# Altium schematic sheet HV_Amp_Discrete.SchDoc: Power
size 420 x 297 mm; Author: G.Kasprowicz; CompanyName: WUT ISE; DrawnBy: G.Kasprowicz; Organization: WUT ISE; Address1: PW ISE; Address2: Nowowiejska 15/19 00-665 Warsaw; Address3: gkasprow@gmail.com; DocumentNumber: 2; Revision: 2; SheetNumber: 11; SheetTotal: 12; ModifiedBy: -; CheckedDate: -; Title2: Stage; DivGrp: WUT ISE; Designer: G.Kasprowicz; ModifiedDate: -; ProjectName: Sensor Box
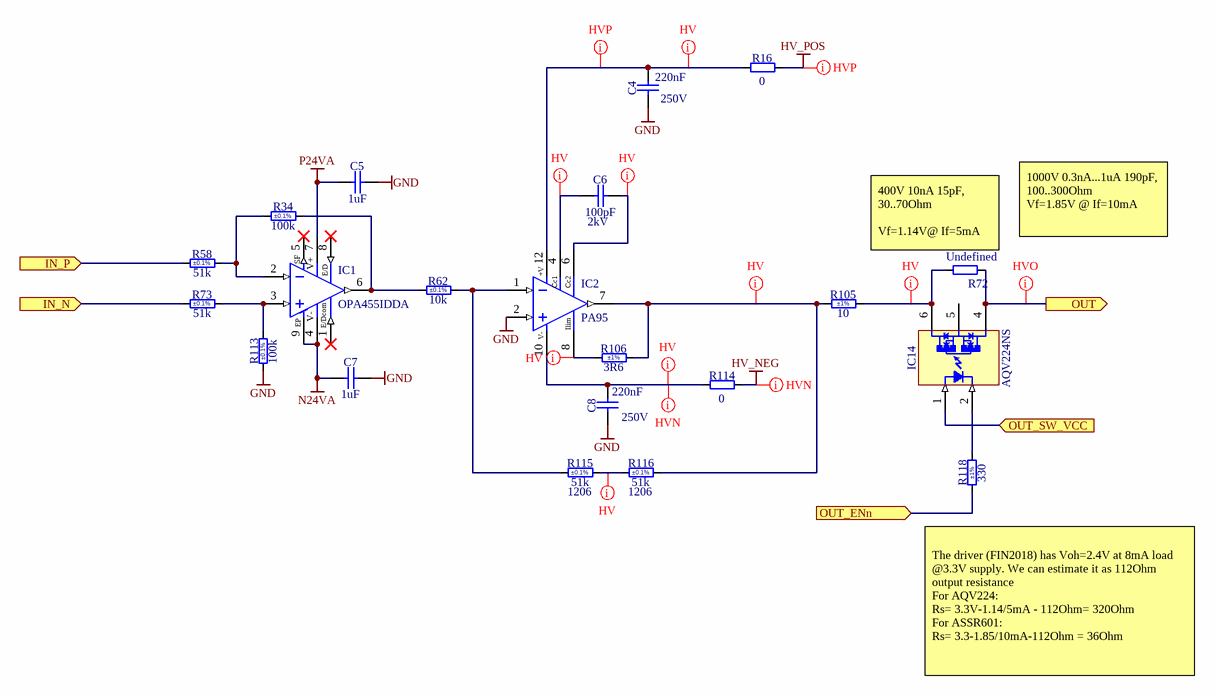
[diagram p0: HV_Amp_Discrete.SchDoc]

## Parts
C4  220nF  Voltage: 250V  [CAPC4532X165N]
C5  1uF  [CAPC1608X87N]
C6  100pF  Voltage: 2kV  [CAPC4620X203N]
C7  1uF  [CAPC1608X87N]
C8  220nF  Voltage: 250V  [CAPC4532X165N]
IC1  OPA455IDDA  [SOIC127P600X170-9N-R249X300]
IC2  PA95  [APEX_PA95_hflip]
IC14  AQV224NS  [PANASONIC_AQV22(SOP)]
R16  0  [RESC1608X55N]
R34  100k  Tolerance: ±0.1%  [RESC1608X55N]
R58  51k  Tolerance: ±0.1%  [RESC2012X60N]
R62  10k  Tolerance: ±0.1%  [RESC1608X64N]
R72  Undefined  [RESC3216X65N]
R73  51k  Tolerance: ±0.1%  [RESC2012X60N]
R105  10  Tolerance: ±1%  [RESC3216X65N]
R106  3R6  Tolerance: ±1%  [RESC1608X55N]
R113  100k  Tolerance: ±0.1%  [RESC1608X55N]
R114  0  [RESC1608X55N]
R115  51k  Tolerance: ±0.1%  Case: 1206  [RESC3216X65N]
R116  51k  Tolerance: ±0.1%  Case: 1206  [RESC3216X65N]
R118  330  Tolerance: ±1%  [RESC1005X40N]

## Ports
IN_N (in), IN_P (in), OUT (out), OUT_ENn (in), OUT_SW_VCC (in)

## Nets
GND: C4.1 C5.2 C7.2 C8.1 IC2.2(IN+) R113.1
HV_NEG: R114.2
HV_POS: R16.2
N24VA: C7.1 IC1.4(V-) IC1.9(Exposed_Pad)
P24VA: C5.1 IC1.7(V+)
IN_N: R73.1 ; port IN_N
IN_P: R58.1 ; port IN_P
OUT: IC14.4 R72.2 ; port OUT
OUT_ENn: R118.1 ; port OUT_ENn
OUT_SW_VCC: IC14.1(A) ; port OUT_SW_VCC
NetC4_2: C4.2 IC2.12(+Vs) R16.1
NetC6_1: C6.1 IC2.4(Cc1)
NetC6_2: C6.2 IC2.6(Cc2)
NetC8_2: C8.2 IC2.10(-Vs) R114.1
NetIC1_2: IC1.2(IN-) R34.1 R58.2
NetIC1_3: IC1.3(IN+) R73.2 R113.2
NetIC1_6: IC1.6(OUT) R34.2 R62.1
NetIC2_1: IC2.1(IN-) R62.2 R115.1
NetIC2_7: IC2.7(OUT) R105.1 R106.2 R116.2
NetIC2_8: IC2.8(ILIM) R106.1
NetIC14_2: IC14.2(K) R118.2
NetIC14_6: IC14.6 R72.1 R105.2
NetR115_2: R115.2 R116.1

Not connected (* = marked no-connect by the designer): IC1 1(E/Dcommon)* 5(Status_Flag)* 8(E/B)*; IC14 5

## Layout directives
net class HV: NetC4_2, NetC6_1, NetC6_2, NetC8_2, NetIC2_7, NetIC2_8, NetIC14_6, NetR115_2
net class HVP: HV_POS, NetC4_2
net class HVN: HV_NEG, NetC8_2
net class HVO: OUT

## Notes on the sheet
- (near R72) 400V 10nA 15pF, 30..70Ohm
  Vf=1.14V@ If=5mA
- (near R72) 1000V 0.3nA...1uA 190pF, 100..300Ohm
  Vf=1.85V @ If=10mA
- (near R118) The driver (FIN2018) has Voh=2.4V at 8mA load @3.3V supply. We can estimate it as 112Ohm output resistance
  For AQV224:
  Rs= 3.3V-1.14/5mA - 112Ohm= 320Ohm
  For ASSR601:
  Rs= 3.3-1.85/10mA-112Ohm = 36Ohm
- Project/Equipment
- Document
- Designer
- Drawn by
- Check.by
- Copyright WUT ISE 2020.
  This documentation describes Open Hardware and is licensed under the CERN OHL v.1.2. You may redistribute and modify this documentation under the terms of the CERN OHL v.1.2. (http://ohwr.org/CERNOHL). This documentation is distributed WITHOUT ANY EXPRESS OR IMPLIED WARRANTY, INCLUDING OF MERCHANTABILITY, SATISFACTORY QUALITY AND FITNESS FOR A PARTICULAR PURPOSE. Please see the CERN OHL v.1.2 for applicable conditions.
- Contact
- File
- Last Mod.
- Print Date
- Sheet
- Size
- A3
- of
- Rev
- (in symbol OA_OPA455) SF; E/D; E/Dcom; EP
- (in symbol OA_PA95) +V; V-; Ilim

## Library data of the parts
C4 C8 = CC1812_220NF_250V_10%_X7R_FT-CAP: Non-polarised capacitor; Part Description: Flexible Termination System (FT-CAP) SMD Multilayer Ceramic  Chip Capacitor; Manufacturer: KEMET; Manufacturer Part Number: C1812X224KARACTU; TC: X7R; Tolerance: ±10%; Part Number: CC1812_220NF_250V_10%_X7R_FT-CAP; Component Kind: Standard; Component Type: Standard; Pin Count: 2; Value: 220nF; Status: None; Case: 1812; Mounted: Yes; Socket: No; SMD: Yes; Sense: No; ComponentHeight: 1.65mm; HelpURL: \\cern.ch\dfs\Applications\Altium\Datasheets\CC1812_X7R_KEMET_FT-CAP.pdf; Author: CERN DEM JLC; CreateDate: 09.08.2018; LatestRevisionDate: 09.08.2018
C5 C7 = CC0603_1UF_50V_10%_X5R: Non-polarised capacitor; Part Description: SMD Multilayer Chip Ceramic Capacitor; Manufacturer: GENERIC; Manufacturer1 Part Number: C1608X5R1H105K080; Voltage: 50V; TC: X5R; Tolerance: ±10%; Part Number: CC0603_1UF_50V_10%_X5R; Component Kind: Standard; Component Type: Standard; Pin Count: 2; Value: 1uF; Status: None; Manufacturer Part Number: CC0603_1UF_50V_10%_X5R; Case: 0603; Mounted: Yes; Socket: No; SMD: Yes; Sense: No; Manufacturer1 Example: TDK; Manufacturer1 ComponentHeight: 0.9mm; HelpURL: \\cern.ch\dfs\Applications\Altium\Datasheets\CC0603_X5R_TDK_C.pdf; Author: CERN DEM JMW; CreateDate: 09.11.2015; LatestRevisionDate: 09.11.2015
C6 = CC1808_100PF_2KV_5%_C0G: Non-polarised capacitor; Part Description: High Voltage MLC Chip Capacitor; Manufacturer: GENERIC; Manufacturer1 Part Number: 1808GA101JAT1A; TC: C0G/NP0; Tolerance: ±5%; Part Number: CC1808_100PF_2KV_5%_C0G; Component Kind: Standard; Component Type: Standard; Pin Count: 2; Value: 100pF; Status: None; Manufacturer Part Number: CC1808_100PF_2KV_5%_C0G; Case: 1808; Mounted: Yes; Socket: No; SMD: Yes; Sense: No; Manufacturer1 Example: AVX; Manufacturer1 ComponentHeight: 2.03mm; HelpURL: \\cern.ch\dfs\Applications\Altium\Datasheets\CC1808_C0G_AVX_HV-MLC.pdf; Author: CERN DEM JLC; CreateDate: 25.11.2014; LatestRevisionDate: 16.11.2017
IC1 = OA_OPA455: High-Voltage (150V), High-Current (50mA) Operational Amplifier, G=1 Stable; Manufacturer: TEXAS INSTRUMENTS; PressFit: No; Bonding: No; Part Number: OPA455IDDA; Component Kind: Standard; Component Type: Standard; Device: OPA455IDDA; PackageDescription: SOIC, 1.27mm Pitch; 8 Pin, 4.00mm W X 5.00mm L X 1.70mm H body (w/Thermal Tab 2.49 X 3.00mm), IPC Medium Density; Part Description: High-Voltage (150V), High-Current (50mA) Operational Amplifier, G=1 Stable; Manufacturer Part Number: OPA455IDDA; Pin Count: 9; Case: SOIC8; Mounted: Yes; Socket: No; SMD: Yes; Sense: No; ComponentHeight: 1.70mm; Author: GK; HelpURL: \\cern.ch\dfs\Applications\Altium\Datasheets\OPA454AIDDA.pdf; CreateDate: 23.05.2011; LatestRevisionDate: 23.05.2011
IC2 = OA_PA95: High Voltage Power Operational Amplifier; Part Number: PA95_hflip; Part Description: 100mA 900V High Voltage Power Operational Amplifier (DQ Case Style); Manufacturer: APEX; PressFit: No; Bonding: No; Component Kind: Standard; Component Type: Standard; Device: PA95; PackageDescription: Power SIP, DQ Package Style, Pitch 2.54mm, Reverse Right Angle Formed Original Straight Leads For Flipped  Horizontal Mount; Manufacturer Part Number: PA95; Pin Count: 8; Mounted: Yes; Socket: No; SMD: No; Sense: No; ComponentHeight: 10mm; Author: GK; HelpURL: \\cern.ch\dfs\Applications\Altium\Datasheets\PA94.pdf; ComponentLink1URL: \\cern.ch\dfs\Applications\Altium\Datasheets\PA94_v_Package.pdf; ComponentLink1Description: Package Drawing; CreateDate: 04.12.2008; LatestRevisionDate: 12.01.2010
IC14 = OPTOMOS_AQV224NS: PhotoMOS Relay 400V 40mA; Part Description: GU SOP 1 Form A, PhotoMOS Relay, 400V 40mA; Manufacturer: PANASONIC; PressFit: No; Bonding: No; Part Number: AQV224NS; Component Kind: Standard; Component Type: Standard; Device: AQV224NS; Footprint: PANASONIC_AQV224NS; PackageDescription: PANASONIC Serie AQV21(SOP), 2.54mm Pitch; 6 Pin, 4.40mm W X 6.30mm L X 2.30mm H body; Manufacturer Part Number: AQV224NS; Pin Count: 6; Case: SOP6; Mounted: Yes; Socket: No; SMD: Yes; Sense: No; ComponentHeight: 2.3mm; HelpURL: \\cern.ch\dfs\Applications\Altium\Datasheets\AQV212S.pdf; ComponentLink1Description: Package Drawing; ComponentLink1URL: \\cern.ch\dfs\Applications\Altium\Datasheets\AQV21_Package-Drawing.pdf; Author: GK; CreateDate: 03.09.2010; LatestRevisionDate: 04.12.2018
R16 R114 = R0603_0R_JUMPER: Resistor; Part Description: 1A (0.05R Max DC Resistance) Zero Ohm Jumper; Manufacturer: GENERIC; Manufacturer1 Part Number: NRC06Z0; PressFit: No; Part Number: R0603_0R_JUMPER; Component Kind: Standard; Component Type: Standard; Pin Count: 2; Value: 0; Status: Preferred; Manufacturer Part Number: R0603_0R_JUMPER; Case: 0603; Mounted: Yes; Sense: No; Socket: No; SMD: Yes; Manufacturer1 Example: NIC COMPONENT; Manufacturer1 ComponentHeight: 0.55mm; HelpURL: \\cern.ch\dfs\Applications\Altium\Datasheets\R0603_NIC_NRC.pdf; Author: CERN DEM JLC; CreateDate: 03.12.2007; LatestRevisionDate: 13.03.2008
R34 R113 = R0603_100K_0.1%_0.063W_10PPM: Resistor - 0.1%; Part Description: Thin Film Chip Resistor; Manufacturer: GENERIC; Manufacturer1 Part Number: RN73C1J100KBTDF; Power: 0.063W; TC: ±10ppm; PressFit: No; Part Number: R0603_100K_0.1%_0.063W_10PPM; Component Kind: Standard; Component Type: Standard; Pin Count: 2; Value: 100k; Status: Not Recommended; Manufacturer Part Number: R0603_100K_0.1%_0.063W_10PPM; Case: 0603; Mounted: Yes; Sense: No; Socket: No; SMD: Yes; Manufacturer1 Example: TYCO HOLSWORTHY; Manufacturer1 ComponentHeight: 0.55mm; HelpURL: \\cern.ch\dfs\Applications\Altium\Datasheets\R0603_Tyco_RN73.pdf; Author: CERN DEM JLC; CreateDate: 03.12.2007; LatestRevisionDate: 13.03.2008
R58 R73 = R0805_51K_0.1%_0.125W_10PPM: Resistor - 0.1%; Part Description: Thin Film Chip Resistor; Manufacturer: GENERIC; Manufacturer1 Part Number: ERA6ARB513V; Power: 0.125W; TC: ±10ppm; PressFit: No; Part Number: R0805_51K_0.1%_0.125W_10PPM; Component Kind: Standard; Component Type: Standard; Pin Count: 2; Value: 51k; Status: Not Recommended; Manufacturer Part Number: R0805_51K_0.1%_0.125W_10PPM; Case: 0805; Mounted: Yes; Sense: No; Socket: No; SMD: Yes; Manufacturer1 Example: PANASONIC; Manufacturer1 ComponentHeight: 0.6mm; HelpURL: \\cern.ch\dfs\Applications\Altium\Datasheets\R0805_PANASONIC_ERA.pdf; Author: CERN DEM BC; CreateDate: 26.09.2019; LatestRevisionDate: 26.09.2019
R62 = R0603_10K_0.1%_0.1W_25PPM: Resistor - 0.1%; Part Description: Thin Film Chip Resistor; Manufacturer: GENERIC; Manufacturer1 Part Number: ERA3AEB103V; Power: 0.1W; TC: ±25ppm/°C; PressFit: No; Part Number: R0603_10K_0.1%_0.1W_25PPM; Component Kind: Standard; Component Type: Standard; Pin Count: 2; Value: 10k; Status: Not Recommended; Manufacturer Part Number: R0603_10K_0.1%_0.1W_25PPM; Case: 0603; Mounted: Yes; Sense: No; Socket: No; SMD: Yes; Manufacturer1 Example: PANASONIC; Manufacturer1 ComponentHeight: 0.55mm; HelpURL: \\cern.ch\dfs\Applications\Altium\Datasheets\R0603_PANASONIC_ERA.pdf; Author: CERN DEM JMW; CreateDate: 09.11.2015; LatestRevisionDate: 11.01.2017
R72 = R1206_NO-VALUE: Resistor; Part Description: Reserved Footprint For a 1206 (3216) Chip Resistor; PressFit: No; Mounted: No; Part Number: R1206_NO-VALUE; Component Kind: Standard; Component Type: Standard; Pin Count: 2; Value: Undefined; Status: None; Manufacturer: Undefined; Manufacturer Part Number: R1206_NO-VALUE; Case: 1206; Sense: No; Socket: No; SMD: Yes; Manufacturer1 Example: Undefined; Manufacturer1 Part Number: Undefined; Manufacturer1 ComponentHeight: Undefined; HelpURL: Undefined; Author: CERN DEM JLC; CreateDate: 03.12.2007; LatestRevisionDate: 13.03.2008
R105 = R1206_10R_1%_0.25W_200PPM: Resistor - 1%; Part Description: General Purpose Thick Film Chip Resistor; Manufacturer: GENERIC; Manufacturer1 Part Number: NRC12F10R0TRF; Power: 0.25W; TC: ±200ppm/°C; PressFit: No; Part Number: R1206_10R_1%_0.25W_200PPM; Component Kind: Standard; Component Type: Standard; Pin Count: 2; Value: 10; Status: Preferred; Manufacturer Part Number: R1206_10R_1%_0.25W_200PPM; Case: 1206; Mounted: Yes; Sense: No; Socket: No; SMD: Yes; Manufacturer1 Example: NIC COMPONENT; Manufacturer1 ComponentHeight: 0.65mm; HelpURL: \\cern.ch\dfs\Applications\Altium\Datasheets\R1206_NIC_NRC.pdf; Author: CERN DEM JLC; CreateDate: 24.06.2009; LatestRevisionDate: 24.06.2009
R106 = R0603_3R6_1%_0.1W_200PPM: Resistor - 1%; Part Description: General Purpose Thick Film Chip Resistor; Manufacturer: GENERIC; Manufacturer1 Part Number: 232270463608L or RC0603FR-073R6L; Power: 0.1W; TC: ±200ppm/°C; PressFit: No; Part Number: R0603_3R6_1%_0.1W_200PPM; Component Kind: Standard; Component Type: Standard; Pin Count: 2; Value: 3R6; Status: Preferred; Manufacturer Part Number: R0603_3R6_1%_0.1W_200PPM; Case: 0603; Mounted: Yes; Sense: No; Socket: No; SMD: Yes; Manufacturer1 Example: YAGEO PHYCOMP; Manufacturer1 ComponentHeight: 0.65mm; HelpURL: \\cern.ch\dfs\Applications\Altium\Datasheets\R0603_Phycomp_RC0603.pdf; Author: CERN DEM JLC; CreateDate: 03.12.2007; LatestRevisionDate: 17.10.2012
R115 R116 = R1206_51K_0.1%_0.25W_25PPM: Resistor - 0.1%; Part Description: Thin Film Chip Resistor; Manufacturer: GENERIC; Manufacturer1 Part Number: RN73H2BTTD5102B25; Power: 0.25W; TC: ±25ppm/°C; PressFit: No; Part Number: R1206_51K_0.1%_0.25W_25PPM; Component Kind: Standard; Component Type: Standard; Pin Count: 2; Value: 51k; Status: Not Recommended; Manufacturer Part Number: R1206_51K_0.1%_0.25W_25PPM; Mounted: Yes; Sense: No; Socket: No; SMD: Yes; Manufacturer1 Example: KOA; Manufacturer1 ComponentHeight: 0.70mm; HelpURL: \\cern.ch\dfs\Applications\Altium\Datasheets\R1206_KOA_RN73H.pdf; Author: CERN DEM JLC; CreateDate: 03.12.2007; LatestRevisionDate: 13.03.2008
R118 = R0402_330R_1%_0.0625W_100PPM: Resistor - 1%; Part Description: General Purpose Thick Film Chip Resistor; Manufacturer: GENERIC; Manufacturer1 Part Number: 232270673301L; TC: ±100ppm/°C; PressFit: No; Part Number: R0402_330R_1%_0.0625W_100PPM; Component Kind: Standard; Component Type: Standard; Pin Count: 2; Value: 330; Status: Not Recommended; Power: 0.0625W; Manufacturer Part Number: R0402_330R_1%_0.0625W_100PPM; Case: 0402; Mounted: Yes; Sense: No; Socket: No; SMD: Yes; Manufacturer1 Example: YAGEO PHYCOMP; Manufacturer1 ComponentHeight: 0.4mm; HelpURL: \\cern.ch\dfs\Applications\Altium\Datasheets\R0402_Phycomp_RC0402.pdf; Author: CERN DEM JLC; CreateDate: 03.12.2007; LatestRevisionDate: 17.10.2012